# EAGLE design backplane (EAGLE 8.0.0)
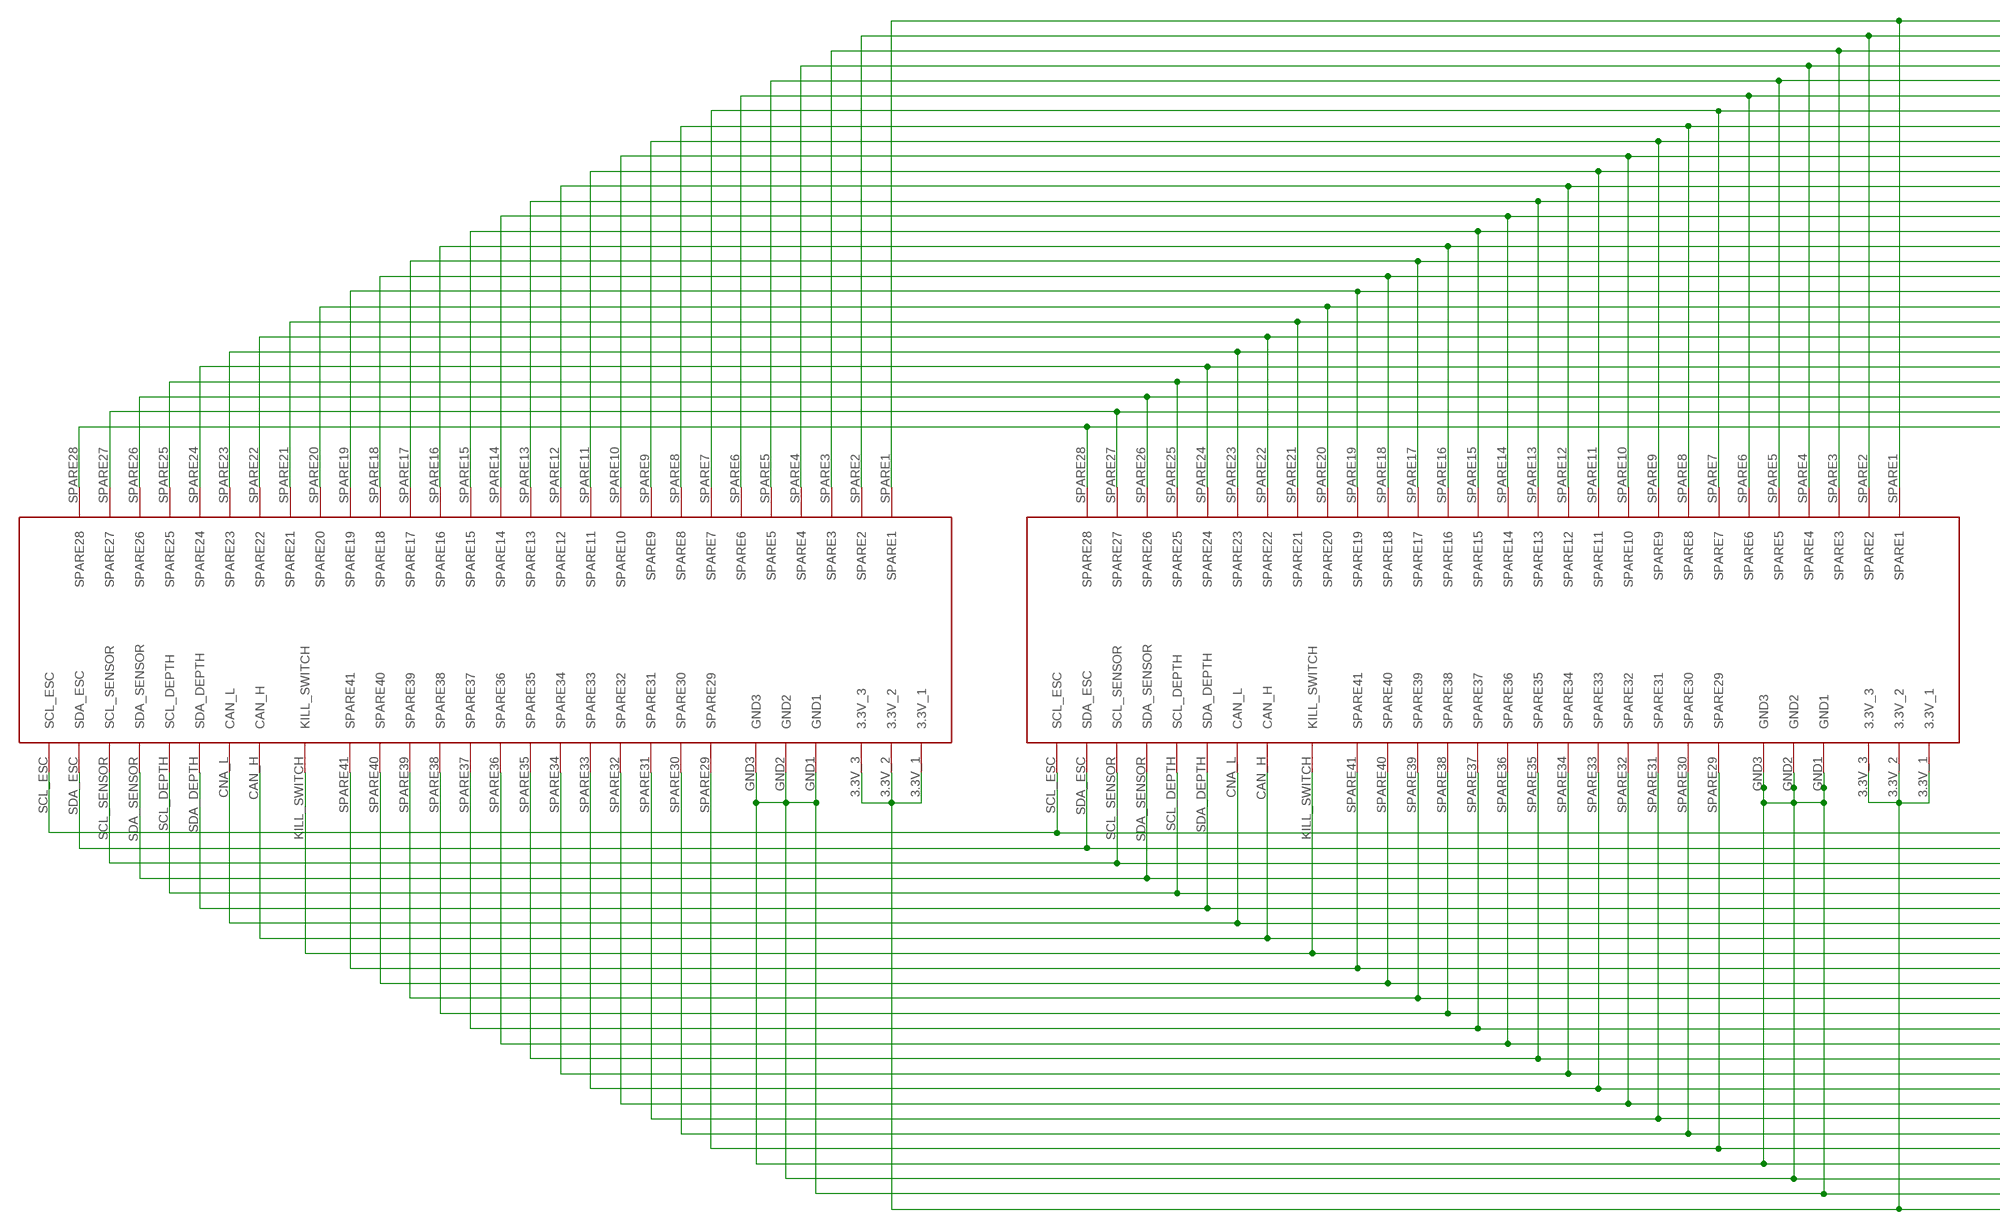
[diagram p0: schematic, sheet 1, part 1 of 2]
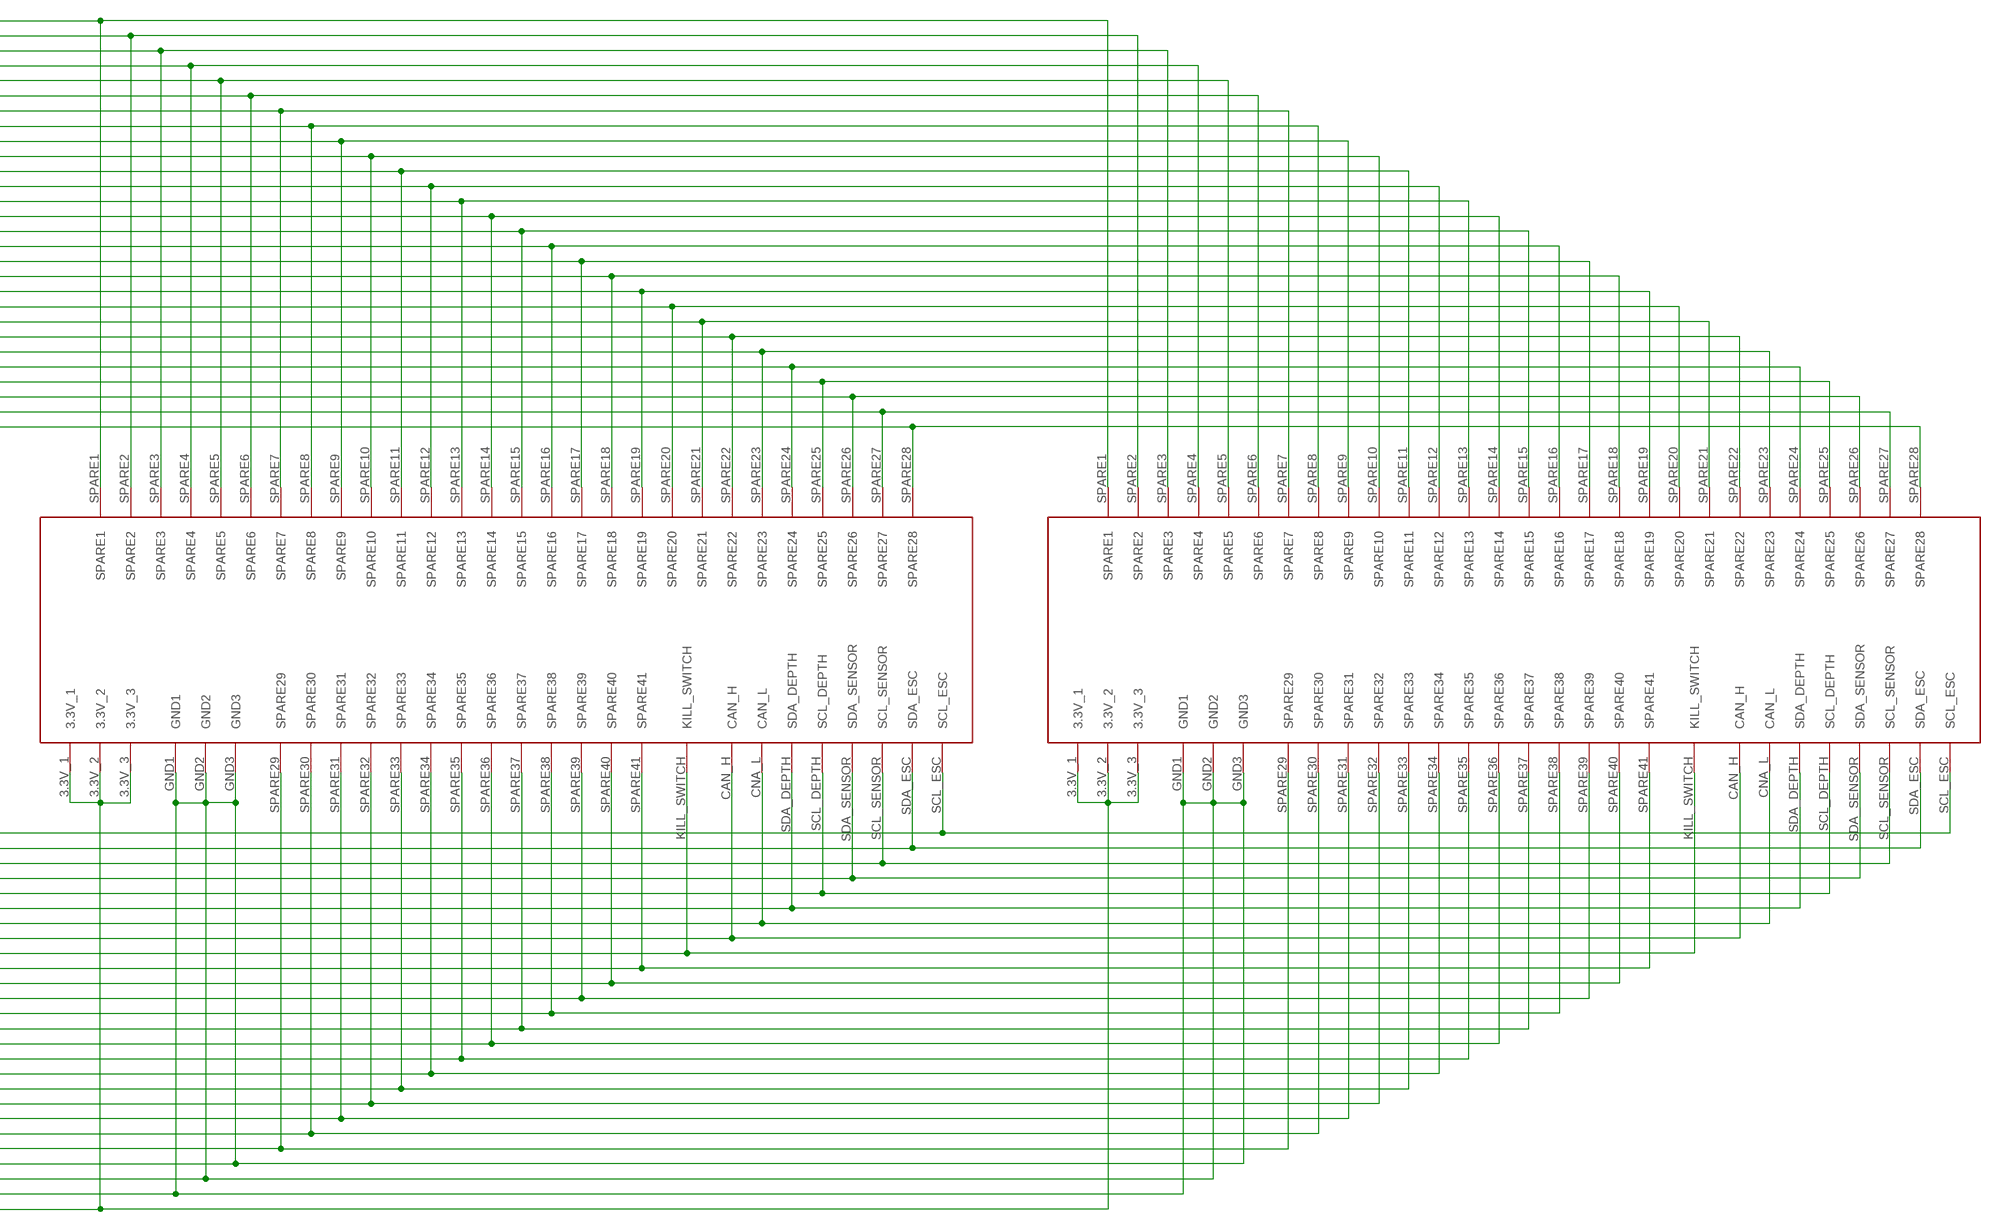
[diagram p1: schematic, sheet 1, part 2 of 2]

## Parts
CO-PROCESSOR  5530843_MATE  [5530843-6-BACKPLANEMATE]
CONVERTER  5530843_MATE  [5530843-6-BACKPLANEMATE]
EXTRA  5530843_MATE  [5530843-6-BACKPLANEMATE]
LOAD_BALANCER  5530843_MATE  [5530843-6-BACKPLANEMATE]

## Nets
3.3: CO-PROCESSOR.3.3V_1 CO-PROCESSOR.3.3V_2 CO-PROCESSOR.3.3V_3 CO-PROCESSOR.SPARE1 CO-PROCESSOR.SPARE2 CO-PROCESSOR.SPARE3 CONVERTER.3.3V_1 CONVERTER.3.3V_2 CONVERTER.3.3V_3 CONVERTER.SPARE1 CONVERTER.SPARE2 CONVERTER.SPARE3 EXTRA.3.3V_1 EXTRA.3.3V_2 EXTRA.3.3V_3 EXTRA.SPARE1 EXTRA.SPARE2 EXTRA.SPARE3 LOAD_BALANCER.3.3V_1 LOAD_BALANCER.3.3V_2 LOAD_BALANCER.3.3V_3 LOAD_BALANCER.SPARE1 LOAD_BALANCER.SPARE2 LOAD_BALANCER.SPARE3
CAN_H: CO-PROCESSOR.CAN_H CONVERTER.CAN_H EXTRA.CAN_H LOAD_BALANCER.CAN_H
CAN_L: CO-PROCESSOR.CNA_L(CAN_L) CONVERTER.CNA_L(CAN_L) EXTRA.CNA_L(CAN_L) LOAD_BALANCER.CNA_L(CAN_L)
GND: CO-PROCESSOR.GND1 CO-PROCESSOR.GND2 CO-PROCESSOR.GND3 CO-PROCESSOR.SPARE4 CO-PROCESSOR.SPARE5 CO-PROCESSOR.SPARE6 CONVERTER.GND1 CONVERTER.GND2 CONVERTER.GND3 CONVERTER.SPARE4 CONVERTER.SPARE5 CONVERTER.SPARE6 EXTRA.GND1 EXTRA.GND2 EXTRA.GND3 EXTRA.SPARE4 EXTRA.SPARE5 EXTRA.SPARE6 LOAD_BALANCER.GND1 LOAD_BALANCER.GND2 LOAD_BALANCER.GND3 LOAD_BALANCER.SPARE4 LOAD_BALANCER.SPARE5 LOAD_BALANCER.SPARE6
KILL_SWITCH: CO-PROCESSOR.KILL_SWITCH CONVERTER.KILL_SWITCH EXTRA.KILL_SWITCH LOAD_BALANCER.KILL_SWITCH
SCL_DEPTH: CO-PROCESSOR.SCL_DEPTH CONVERTER.SCL_DEPTH EXTRA.SCL_DEPTH LOAD_BALANCER.SCL_DEPTH
SCL_ESC: CO-PROCESSOR.SCL_ESC CONVERTER.SCL_ESC EXTRA.SCL_ESC LOAD_BALANCER.SCL_ESC
SCL_SENSOR: CO-PROCESSOR.SCL_SENSOR CONVERTER.SCL_SENSOR EXTRA.SCL_SENSOR LOAD_BALANCER.SCL_SENSOR
SDA_DEPTH: CO-PROCESSOR.SDA_DEPTH CONVERTER.SDA_DEPTH EXTRA.SDA_DEPTH LOAD_BALANCER.SDA_DEPTH
SDA_ESC: CO-PROCESSOR.SDA_ESC CONVERTER.SDA_ESC EXTRA.SDA_ESC LOAD_BALANCER.SDA_ESC
SDA_SENSOR: CO-PROCESSOR.SDA_SENSOR CONVERTER.SDA_SENSOR EXTRA.SDA_SENSOR LOAD_BALANCER.SDA_SENSOR
SPARE7: CO-PROCESSOR.SPARE7 CONVERTER.SPARE7 EXTRA.SPARE7 LOAD_BALANCER.SPARE7
SPARE8: CO-PROCESSOR.SPARE8 CONVERTER.SPARE8 EXTRA.SPARE8 LOAD_BALANCER.SPARE8
SPARE9: CO-PROCESSOR.SPARE9 CONVERTER.SPARE9 EXTRA.SPARE9 LOAD_BALANCER.SPARE9
SPARE10: CO-PROCESSOR.SPARE10 CONVERTER.SPARE10 EXTRA.SPARE10 LOAD_BALANCER.SPARE10
SPARE11: CO-PROCESSOR.SPARE11 CONVERTER.SPARE11 EXTRA.SPARE11 LOAD_BALANCER.SPARE11
SPARE12: CO-PROCESSOR.SPARE12 CONVERTER.SPARE12 EXTRA.SPARE12 LOAD_BALANCER.SPARE12
SPARE13: CO-PROCESSOR.SPARE13 CONVERTER.SPARE13 EXTRA.SPARE13 LOAD_BALANCER.SPARE13
SPARE14: CO-PROCESSOR.SPARE14 CONVERTER.SPARE14 EXTRA.SPARE14 LOAD_BALANCER.SPARE14
SPARE15: CO-PROCESSOR.SPARE15 CONVERTER.SPARE15 EXTRA.SPARE15 LOAD_BALANCER.SPARE15
SPARE16: CO-PROCESSOR.SPARE16 CONVERTER.SPARE16 EXTRA.SPARE16 LOAD_BALANCER.SPARE16
SPARE17: CO-PROCESSOR.SPARE17 CONVERTER.SPARE17 EXTRA.SPARE17 LOAD_BALANCER.SPARE17
SPARE18: CO-PROCESSOR.SPARE18 CONVERTER.SPARE18 EXTRA.SPARE18 LOAD_BALANCER.SPARE18
SPARE19: CO-PROCESSOR.SPARE19 CONVERTER.SPARE19 EXTRA.SPARE19 LOAD_BALANCER.SPARE19
SPARE20: CO-PROCESSOR.SPARE20 CONVERTER.SPARE20 EXTRA.SPARE20 LOAD_BALANCER.SPARE20
SPARE21: CO-PROCESSOR.SPARE21 CONVERTER.SPARE21 EXTRA.SPARE21 LOAD_BALANCER.SPARE21
SPARE22: CO-PROCESSOR.SPARE22 CONVERTER.SPARE22 EXTRA.SPARE22 LOAD_BALANCER.SPARE22
SPARE23: CO-PROCESSOR.SPARE23 CONVERTER.SPARE23 EXTRA.SPARE23 LOAD_BALANCER.SPARE23
SPARE24: CO-PROCESSOR.SPARE24 CONVERTER.SPARE24 EXTRA.SPARE24 LOAD_BALANCER.SPARE24
SPARE25: CO-PROCESSOR.SPARE25 CONVERTER.SPARE25 EXTRA.SPARE25 LOAD_BALANCER.SPARE25
SPARE26: CO-PROCESSOR.SPARE26 CONVERTER.SPARE26 EXTRA.SPARE26 LOAD_BALANCER.SPARE26
SPARE27: CO-PROCESSOR.SPARE27 CONVERTER.SPARE27 EXTRA.SPARE27 LOAD_BALANCER.SPARE27
SPARE28: CO-PROCESSOR.SPARE28 CONVERTER.SPARE28 EXTRA.SPARE28 LOAD_BALANCER.SPARE28
SPARE29: CO-PROCESSOR.SPARE29 CONVERTER.SPARE29 EXTRA.SPARE29 LOAD_BALANCER.SPARE29
SPARE30: CO-PROCESSOR.SPARE30 CONVERTER.SPARE30 EXTRA.SPARE30 LOAD_BALANCER.SPARE30
SPARE31: CO-PROCESSOR.SPARE31 CONVERTER.SPARE31 EXTRA.SPARE31 LOAD_BALANCER.SPARE31
SPARE32: CO-PROCESSOR.SPARE32 CONVERTER.SPARE32 EXTRA.SPARE32 LOAD_BALANCER.SPARE32
SPARE33: CO-PROCESSOR.SPARE33 CONVERTER.SPARE33 EXTRA.SPARE33 LOAD_BALANCER.SPARE33
SPARE34: CO-PROCESSOR.SPARE34 CONVERTER.SPARE34 EXTRA.SPARE34 LOAD_BALANCER.SPARE34
SPARE35: CO-PROCESSOR.SPARE35 CONVERTER.SPARE35 EXTRA.SPARE35 LOAD_BALANCER.SPARE35
SPARE36: CO-PROCESSOR.SPARE36 CONVERTER.SPARE36 EXTRA.SPARE36 LOAD_BALANCER.SPARE36
SPARE37: CO-PROCESSOR.SPARE37 CONVERTER.SPARE37 EXTRA.SPARE37 LOAD_BALANCER.SPARE37
SPARE38: CO-PROCESSOR.SPARE38 CONVERTER.SPARE38 EXTRA.SPARE38 LOAD_BALANCER.SPARE38
SPARE39: CO-PROCESSOR.SPARE39 CONVERTER.SPARE39 EXTRA.SPARE39 LOAD_BALANCER.SPARE39
SPARE40: CO-PROCESSOR.SPARE40 CONVERTER.SPARE40 EXTRA.SPARE40 LOAD_BALANCER.SPARE40
SPARE41: CO-PROCESSOR.SPARE41 CONVERTER.SPARE41 EXTRA.SPARE41 LOAD_BALANCER.SPARE41

## Library data of the parts
CO-PROCESSOR CONVERTER EXTRA LOAD_BALANCER = 5530843-6 - backplane:5530843_MATE

## Board
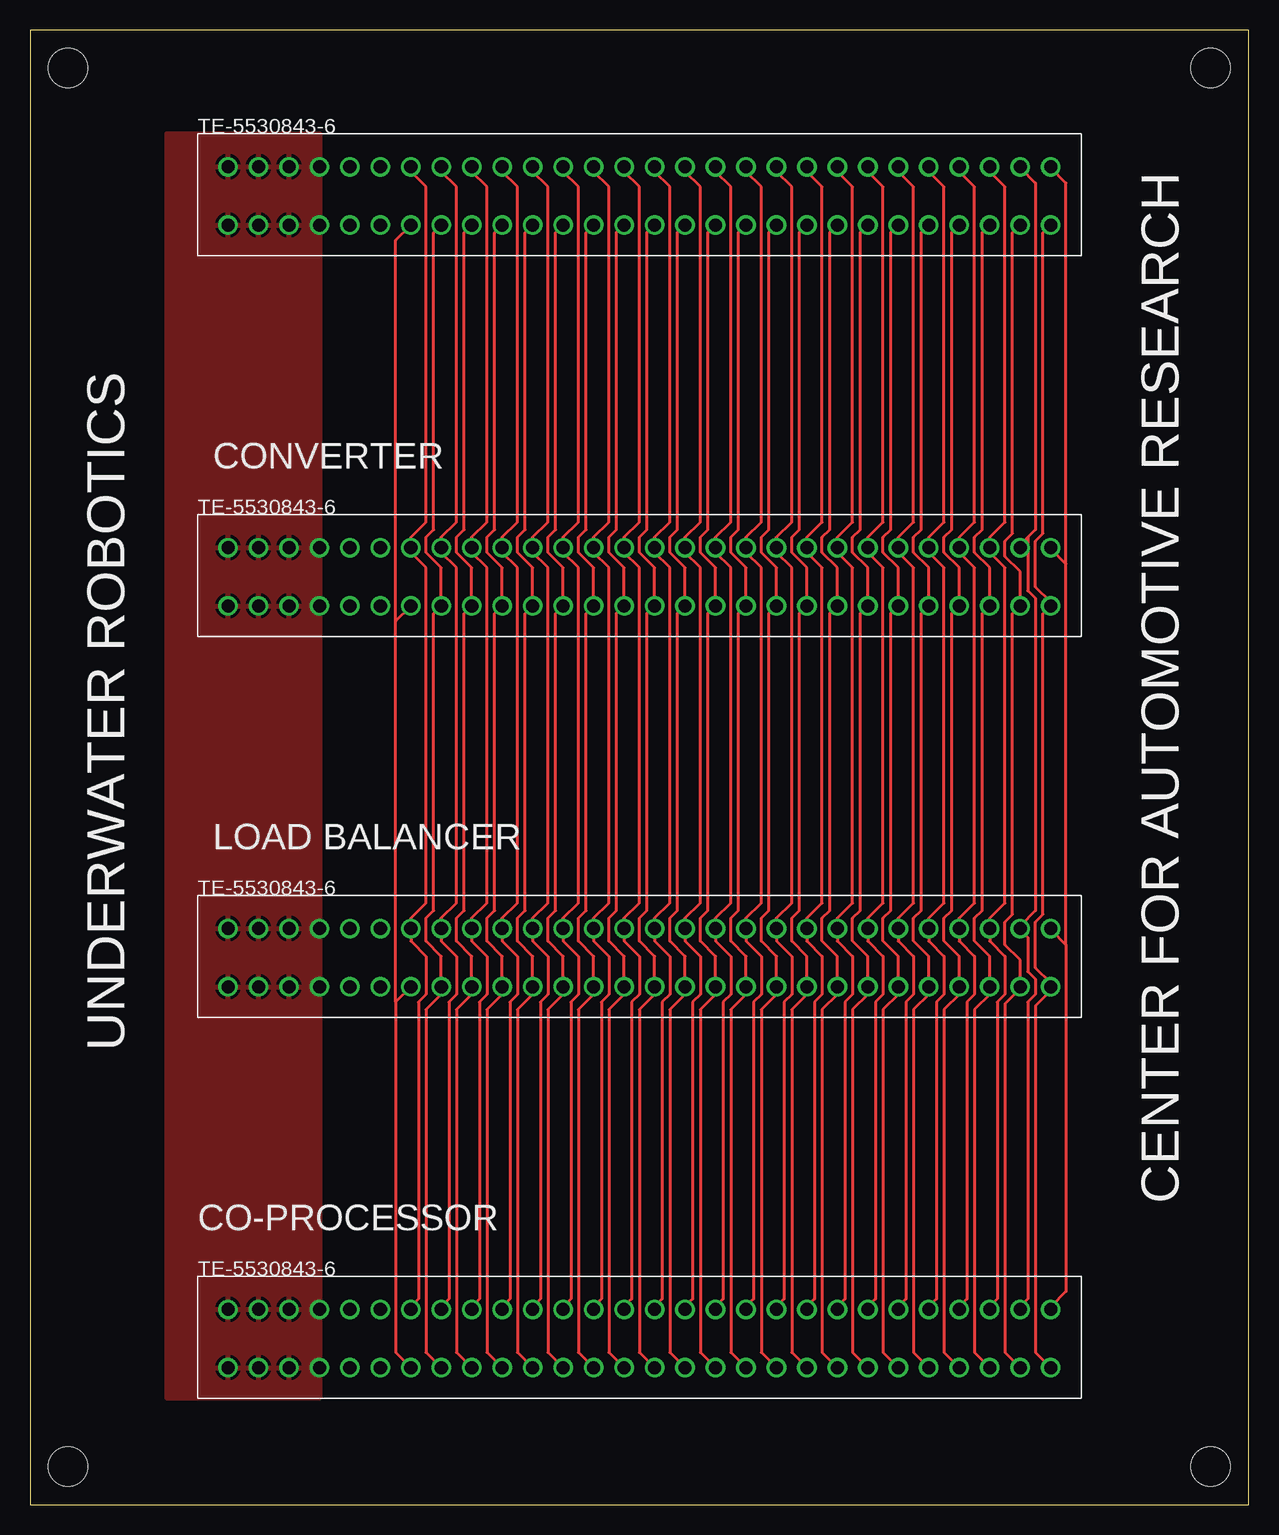
[diagram p2: board, top side]
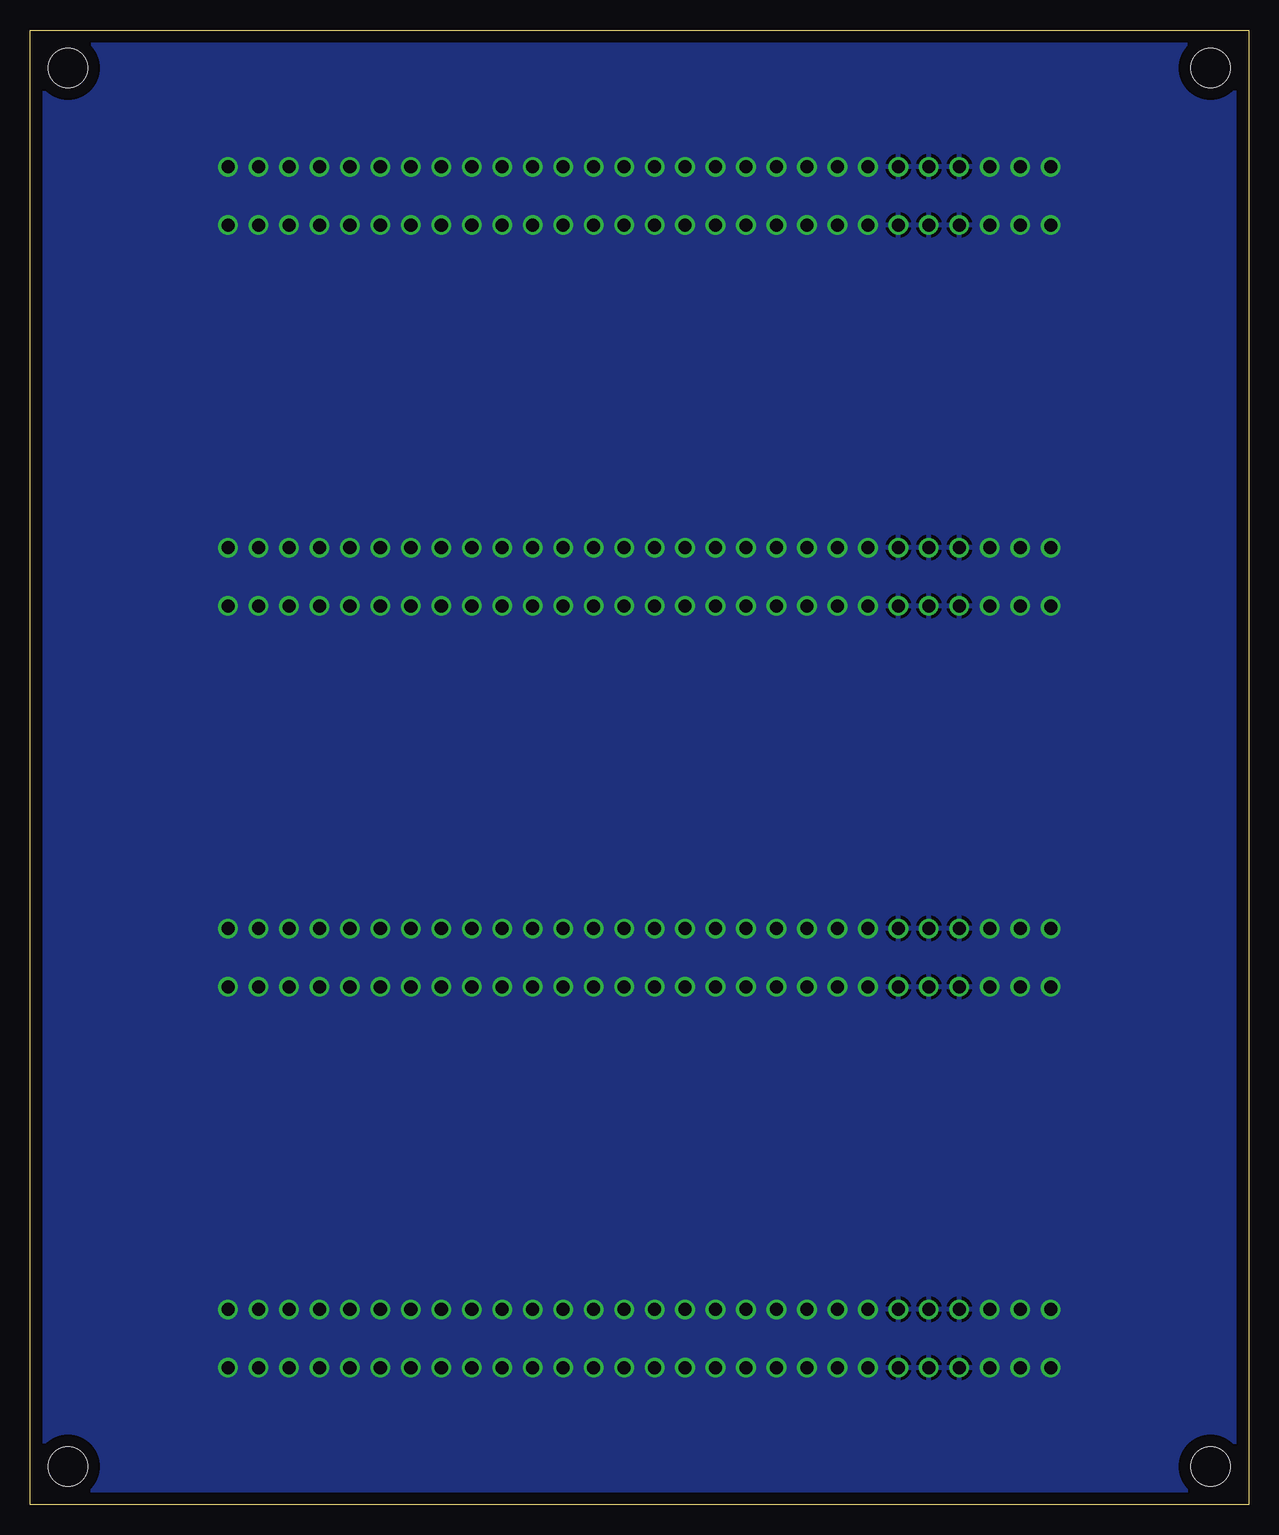
[diagram p3: board, bottom side, seen from below]

Size 101.6 x 122.94 mm. Coordinates in mm from the lower left corner, seen from the top.
Outline: 0,0 101.6,0 101.6,122.94 0,122.94 0,0
Copper layers (1*16): Top 0.035mm / dielectric 1.5mm / Bottom 0.035mm
Design rules "default *": minimum track width 10mil, minimum drill 24mil, track to track 0.000153125mm, track to pad 8mil, pad to pad 8mil, via to via 8mil, smd to smd 8mil, copper to edge 40mil, drill to drill 8mil, minimum pad ring 10mil, minimum via ring 8mil, stop-mask expansion 4mil, vias tented up to drill 0mil, thermal gap 10mil
Holes 3.26 mm at 3.17,3.17 3.17,119.76 98.42,119.76 98.42,3.17

### Footprints (pad centres in the part's own frame; a part is rotated, then mirrored left to right if it is on the bottom)
5530843-6-BACKPLANEMATE = drill 1.092: 3.3V_1 0,0; 3.3V_2 2.54,0; 3.3V_3 5.08,0; CAN_H 50.8,0; CNA_L 53.34,0; GND1 7.62,0; GND2 10.16,0; GND3 12.7,0; KILL_SWITCH 48.26,0; SCL_DEPTH 58.42,0; SCL_ESC 68.58,0; SCL_SENSOR 63.5,0; SDA_DEPTH 55.88,0; SDA_ESC 66.04,0; SDA_SENSOR 60.96,0; SPARE1 0,4.851; SPARE2 2.54,4.851; SPARE3 5.08,4.851; SPARE4 7.62,4.851; SPARE5 10.16,4.851; SPARE6 12.7,4.851; SPARE7 15.24,4.851; SPARE8 17.78,4.851; SPARE9 20.32,4.851; SPARE10 22.86,4.851; SPARE11 25.4,4.851; SPARE12 27.94,4.851; SPARE13 30.48,4.851; SPARE14 33.02,4.851; SPARE15 35.56,4.851; SPARE16 38.1,4.851; SPARE17 40.64,4.851; SPARE18 43.18,4.851; SPARE19 45.72,4.851; SPARE20 48.26,4.851; SPARE21 50.8,4.851; SPARE22 53.34,4.851; SPARE23 55.88,4.851; SPARE24 58.42,4.851; SPARE25 60.96,4.851; SPARE26 63.5,4.851; SPARE27 66.04,4.851; SPARE28 68.58,4.851; SPARE29 15.24,0; SPARE30 17.78,0; SPARE31 20.32,0; SPARE32 22.86,0; SPARE33 25.4,0; SPARE34 27.94,0; SPARE35 30.48,0; SPARE36 33.02,0; SPARE37 35.56,0; SPARE38 38.1,0; SPARE39 40.64,0; SPARE40 43.18,0; SPARE41 45.72,0

### Placement (x,y rotation side)
CO-PROCESSOR  16.51,11.43 0 top
CONVERTER  16.51,106.68 0 top
EXTRA  16.51,74.93 0 top
LOAD_BALANCER  16.51,43.18 0 top

### Tracks (layer width: path | path; a pad name or v marks a point on that pad's centre or on a via)
3.3
  pour Top: 11.43,114.3 24.13,114.3 24.13,8.89 11.43,8.89
CAN_H
  Top 0.254: CO-PROCESSOR.CAN_H 66.04,12.7 66.04,41.27 67.31,42.55 LOAD_BALANCER.CAN_H 67.31,45.72 66.04,46.99 66.04,48.9 66.67,49.53 66.67,74.3 EXTRA.CAN_H 67.31,78.11 66.04,79.38 66.04,80.64 66.67,81.28 66.67,106.05 CONVERTER.CAN_H
CAN_L
  Top 0.254: CO-PROCESSOR.CNA_L 68.58,12.7 68.58,41.27 69.85,42.55 LOAD_BALANCER.CNA_L 69.85,45.72 68.58,46.99 68.58,48.9 69.22,49.53 69.22,74.3 EXTRA.CNA_L 69.85,78.11 68.58,79.38 68.58,80.64 69.22,81.28 69.22,106.05 CONVERTER.CNA_L
GND
  pour Bottom: 0,122.94 101.6,122.94 101.6,0 0,0
KILL_SWITCH
  Top 0.254: CO-PROCESSOR.KILL_SWITCH 63.5,12.7 63.5,41.27 64.77,42.55 LOAD_BALANCER.KILL_SWITCH 64.77,45.72 63.5,46.99 63.5,48.9 64.14,49.53 64.14,74.3 EXTRA.KILL_SWITCH 64.77,78.11 63.5,79.38 63.5,80.64 64.14,81.28 64.14,106.05 CONVERTER.KILL_SWITCH
SCL_DEPTH
  Top 0.254: CO-PROCESSOR.SCL_DEPTH 73.66,12.7 73.66,41.27 74.93,42.55 LOAD_BALANCER.SCL_DEPTH 74.93,45.72 73.66,46.99 73.66,48.9 74.3,49.53 74.3,74.3 EXTRA.SCL_DEPTH 74.93,78.11 73.66,79.38 73.66,80.64 74.3,81.28 74.3,106.05 CONVERTER.SCL_DEPTH
SCL_ESC
  Top 0.254: CO-PROCESSOR.SCL_ESC 83.82,12.7 83.82,41.59 85.09,42.86 LOAD_BALANCER.SCL_ESC 85.09,43.5 83.82,44.77 83.82,48.58 84.45,49.21 84.45,74.3 EXTRA.SCL_ESC 85.09,75.25 83.82,76.52 83.82,80.33 84.45,80.96 84.45,106.05 CONVERTER.SCL_ESC
SCL_SENSOR
  Top 0.254: CO-PROCESSOR.SCL_SENSOR 78.74,12.7 78.74,41.27 80.01,42.55 LOAD_BALANCER.SCL_SENSOR 80.01,45.72 78.74,46.99 78.74,48.9 79.38,49.53 79.38,74.3 EXTRA.SCL_SENSOR 80.01,78.11 78.74,79.38 78.74,80.64 79.38,81.28 79.38,106.05 CONVERTER.SCL_SENSOR
SDA_DEPTH
  Top 0.254: CO-PROCESSOR.SDA_DEPTH 71.12,12.7 71.12,41.27 72.39,42.55 LOAD_BALANCER.SDA_DEPTH 72.39,45.72 71.12,46.99 71.12,48.9 71.75,49.53 71.75,74.3 EXTRA.SDA_DEPTH 72.39,78.11 71.12,79.38 71.12,80.64 71.75,81.28 71.75,106.05 CONVERTER.SDA_DEPTH
SDA_ESC
  Top 0.254: CO-PROCESSOR.SDA_ESC 81.28,12.7 81.28,41.75 82.55,43.02 LOAD_BALANCER.SDA_ESC 82.55,45.4 81.28,46.67 81.28,48.58 81.92,49.21 81.92,74.3 EXTRA.SDA_ESC 82.55,77.79 81.28,79.06 81.28,80.33 81.92,80.96 81.92,106.05 CONVERTER.SDA_ESC
SDA_SENSOR
  Top 0.254: CO-PROCESSOR.SDA_SENSOR 76.2,12.7 76.2,41.27 77.47,42.55 LOAD_BALANCER.SDA_SENSOR 77.47,45.72 76.2,46.99 76.2,48.9 76.83,49.53 76.83,74.3 EXTRA.SDA_SENSOR 77.47,78.11 76.2,79.38 76.2,80.64 76.83,81.28 76.83,106.05 CONVERTER.SDA_SENSOR
SPARE7
  Top 0.254: CO-PROCESSOR.SPARE7 31.75,16.51 32.38,17.14 32.38,41.91 33.02,42.55 33.02,45.72 31.75,46.99 LOAD_BALANCER.SPARE7 31.75,48.9 33.02,50.16 33.02,78.11 31.75,79.38 EXTRA.SPARE7 31.75,80.64 33.02,81.92 33.02,109.86 31.75,111.12 CONVERTER.SPARE7
SPARE8
  Top 0.254: CO-PROCESSOR.SPARE8 34.29,16.51 34.92,17.14 34.92,41.91 35.56,42.55 35.56,45.72 34.29,46.99 LOAD_BALANCER.SPARE8 34.29,48.9 35.56,50.16 35.56,78.11 34.29,79.38 EXTRA.SPARE8 34.29,80.64 35.56,81.92 35.56,109.86 34.29,111.12 CONVERTER.SPARE8
SPARE9
  Top 0.254: CO-PROCESSOR.SPARE9 36.83,16.51 37.47,17.14 37.47,41.91 38.1,42.55 38.1,45.72 36.83,46.99 LOAD_BALANCER.SPARE9 36.83,48.9 38.1,50.16 38.1,78.11 36.83,79.38 EXTRA.SPARE9 36.83,80.64 38.1,81.92 38.1,109.86 36.83,111.12 CONVERTER.SPARE9
SPARE10
  Top 0.254: CO-PROCESSOR.SPARE10 39.37,16.51 40.01,17.14 40.01,41.91 40.64,42.55 40.64,45.72 39.37,46.99 LOAD_BALANCER.SPARE10 39.37,48.9 40.64,50.16 40.64,78.11 39.37,79.38 EXTRA.SPARE10 39.37,80.64 40.64,81.92 40.64,109.86 39.37,111.12 CONVERTER.SPARE10
SPARE11
  Top 0.254: CO-PROCESSOR.SPARE11 41.91,16.51 42.55,17.14 42.55,41.91 43.18,42.55 43.18,45.72 41.91,46.99 LOAD_BALANCER.SPARE11 41.91,48.9 43.18,50.16 43.18,78.11 41.91,79.38 EXTRA.SPARE11 41.91,80.64 43.18,81.92 43.18,109.86 41.91,111.12 CONVERTER.SPARE11
SPARE12
  Top 0.254: CO-PROCESSOR.SPARE12 44.45,16.51 45.09,17.14 45.09,41.91 45.72,42.55 45.72,45.72 44.45,46.99 LOAD_BALANCER.SPARE12 44.45,48.9 45.72,50.16 45.72,78.11 44.45,79.38 EXTRA.SPARE12 44.45,80.64 45.72,81.92 45.72,109.86 44.45,111.12 CONVERTER.SPARE12
SPARE13
  Top 0.254: CO-PROCESSOR.SPARE13 46.99,16.51 47.62,17.14 47.62,41.91 48.26,42.55 48.26,45.72 46.99,46.99 LOAD_BALANCER.SPARE13 46.99,48.9 48.26,50.16 48.26,78.11 46.99,79.38 EXTRA.SPARE13 46.99,80.64 48.26,81.92 48.26,109.86 46.99,111.12 CONVERTER.SPARE13
SPARE14
  Top 0.254: CO-PROCESSOR.SPARE14 49.53,16.51 50.16,17.14 50.16,41.91 50.8,42.55 50.8,45.72 49.53,46.99 LOAD_BALANCER.SPARE14 49.53,48.9 50.8,50.16 50.8,78.11 49.53,79.38 EXTRA.SPARE14 49.53,80.64 50.8,81.92 50.8,109.86 49.53,111.12 CONVERTER.SPARE14
SPARE15
  Top 0.254: CO-PROCESSOR.SPARE15 52.07,16.51 52.7,17.14 52.7,41.91 53.34,42.55 53.34,45.72 52.07,46.99 LOAD_BALANCER.SPARE15 52.07,48.9 53.34,50.16 53.34,78.11 52.07,79.38 EXTRA.SPARE15 52.07,80.64 53.34,81.92 53.34,109.86 52.07,111.12 CONVERTER.SPARE15
SPARE16
  Top 0.254: CO-PROCESSOR.SPARE16 54.61,16.51 55.24,17.14 55.24,41.91 55.88,42.55 55.88,45.72 54.61,46.99 LOAD_BALANCER.SPARE16 54.61,48.9 55.88,50.16 55.88,78.11 54.61,79.38 EXTRA.SPARE16 54.61,80.64 55.88,81.92 55.88,109.86 54.61,111.12 CONVERTER.SPARE16
SPARE17
  Top 0.254: CO-PROCESSOR.SPARE17 57.15,16.51 57.78,17.14 57.78,41.91 58.42,42.55 58.42,45.72 57.15,46.99 LOAD_BALANCER.SPARE17 57.15,48.9 58.42,50.16 58.42,78.11 57.15,79.38 EXTRA.SPARE17 57.15,80.64 58.42,81.92 58.42,109.86 57.15,111.12 CONVERTER.SPARE17
SPARE18
  Top 0.254: CO-PROCESSOR.SPARE18 59.69,16.51 60.33,17.14 60.33,41.91 60.96,42.55 60.96,45.72 59.69,46.99 LOAD_BALANCER.SPARE18 59.69,48.9 60.96,50.16 60.96,78.11 59.69,79.38 EXTRA.SPARE18 59.69,80.64 60.96,81.92 60.96,109.86 59.69,111.12 CONVERTER.SPARE18
SPARE19
  Top 0.254: CO-PROCESSOR.SPARE19 62.23,16.51 62.87,17.14 62.87,41.91 63.5,42.55 63.5,45.72 62.23,46.99 LOAD_BALANCER.SPARE19 62.23,48.9 63.5,50.16 63.5,78.11 62.23,79.38 EXTRA.SPARE19 62.23,80.64 63.5,81.92 63.5,109.86 62.23,111.12 CONVERTER.SPARE19
SPARE20
  Top 0.254: CO-PROCESSOR.SPARE20 64.77,16.51 65.41,17.14 65.41,41.91 66.04,42.55 66.04,45.72 64.77,46.99 LOAD_BALANCER.SPARE20 64.77,48.9 66.04,50.16 66.04,78.11 64.77,79.38 EXTRA.SPARE20 64.77,80.64 66.04,81.92 66.04,109.86 64.77,111.12 CONVERTER.SPARE20
SPARE21
  Top 0.254: CO-PROCESSOR.SPARE21 67.31,16.51 67.94,17.14 67.94,41.91 68.58,42.55 68.58,45.72 67.31,46.99 LOAD_BALANCER.SPARE21 67.31,48.9 68.58,50.16 68.58,78.11 67.31,79.38 EXTRA.SPARE21 67.31,80.64 68.58,81.92 68.58,109.86 67.31,111.12 CONVERTER.SPARE21
SPARE22
  Top 0.254: CO-PROCESSOR.SPARE22 69.85,16.51 70.48,17.14 70.48,41.91 71.12,42.55 71.12,45.72 69.85,46.99 LOAD_BALANCER.SPARE22 69.85,48.9 71.12,50.16 71.12,78.11 69.85,79.38 EXTRA.SPARE22 69.85,80.64 71.12,81.92 71.12,109.86 69.85,111.12 CONVERTER.SPARE22
SPARE23
  Top 0.254: CO-PROCESSOR.SPARE23 72.39,16.51 73.03,17.14 73.03,41.91 73.66,42.55 73.66,45.72 72.39,46.99 LOAD_BALANCER.SPARE23 72.39,48.9 73.66,50.16 73.66,78.11 72.39,79.38 EXTRA.SPARE23 72.39,80.64 73.66,81.92 73.66,109.86 72.39,111.12 CONVERTER.SPARE23
SPARE24
  Top 0.254: CO-PROCESSOR.SPARE24 74.93,16.51 75.56,17.14 75.56,41.91 76.2,42.55 76.2,45.72 74.93,46.99 LOAD_BALANCER.SPARE24 74.93,48.9 76.2,50.16 76.2,78.11 74.93,79.38 EXTRA.SPARE24 74.93,80.64 76.2,81.92 76.2,109.86 74.93,111.12 CONVERTER.SPARE24
SPARE25
  Top 0.254: CO-PROCESSOR.SPARE25 77.47,16.51 78.11,17.14 78.11,41.91 78.74,42.55 78.74,45.72 77.47,46.99 LOAD_BALANCER.SPARE25 77.47,48.9 78.74,50.16 78.74,78.11 77.47,79.38 EXTRA.SPARE25 77.47,80.64 78.74,81.92 78.74,109.86 77.47,111.12 CONVERTER.SPARE25
SPARE26
  Top 0.254: CO-PROCESSOR.SPARE26 80.01,16.51 80.64,17.14 80.64,41.91 81.28,42.55 81.28,45.72 80.01,46.99 LOAD_BALANCER.SPARE26 80.01,48.9 81.28,50.16 81.28,78.11 80.01,79.38 EXTRA.SPARE26 80.01,80.64 81.28,81.92 81.28,109.86 80.01,111.12 CONVERTER.SPARE26
SPARE27
  Top 0.254: CO-PROCESSOR.SPARE27 82.55,16.51 83.19,17.14 83.19,41.91 83.82,42.55 83.82,43.81 83.19,44.45 83.19,47.31 82.55,47.94 LOAD_BALANCER.SPARE27 82.55,48.26 83.82,49.53 83.82,75.56 83.19,76.2 83.19,80.64 | 83.19,80.64 83.82,81.28 83.82,110.17 82.55,111.44 CONVERTER.SPARE27 | 83.19,80.64 82.55,80.01 EXTRA.SPARE27
SPARE28
  Top 0.254: 86.36,46.67 86.36,17.78 85.09,16.51 CO-PROCESSOR.SPARE28 | 86.36,46.67 85.09,47.94 LOAD_BALANCER.SPARE28 | 86.36,78.42 85.09,79.69 EXTRA.SPARE28 | 86.36,46.67 86.36,78.42 | 86.36,78.42 86.36,110.17 85.09,111.44 CONVERTER.SPARE28
SPARE29
  Top 0.254: CO-PROCESSOR.SPARE29 30.48,12.7 30.48,41.91 | LOAD_BALANCER.SPARE29 30.48,41.91 | 30.48,73.66 EXTRA.SPARE29 | 30.48,41.91 30.48,73.66 | CONVERTER.SPARE29 30.48,105.41 30.48,73.66
SPARE30
  Top 0.254: CO-PROCESSOR.SPARE30 33.02,12.7 33.02,41.27 34.29,42.55 LOAD_BALANCER.SPARE30 34.29,45.72 33.02,46.99 33.02,48.9 33.66,49.53 33.66,74.3 EXTRA.SPARE30 34.29,78.11 33.02,79.38 33.02,80.64 33.66,81.28 33.66,106.05 CONVERTER.SPARE30
SPARE31
  Top 0.254: CO-PROCESSOR.SPARE31 35.56,12.7 35.56,41.27 36.83,42.55 LOAD_BALANCER.SPARE31 36.83,45.72 35.56,46.99 35.56,48.9 36.2,49.53 36.2,74.3 EXTRA.SPARE31 36.83,78.11 35.56,79.38 35.56,80.64 36.2,81.28 36.2,106.05 CONVERTER.SPARE31
SPARE32
  Top 0.254: CO-PROCESSOR.SPARE32 38.1,12.7 38.1,41.27 39.37,42.55 LOAD_BALANCER.SPARE32 39.37,45.72 38.1,46.99 38.1,48.9 38.73,49.53 38.73,74.3 EXTRA.SPARE32 39.37,78.11 38.1,79.38 38.1,80.64 38.73,81.28 38.73,106.05 CONVERTER.SPARE32
SPARE33
  Top 0.254: CO-PROCESSOR.SPARE33 40.64,12.7 40.64,41.27 41.91,42.55 LOAD_BALANCER.SPARE33 41.91,45.72 40.64,46.99 40.64,48.9 41.27,49.53 41.27,74.3 EXTRA.SPARE33 41.91,78.11 40.64,79.38 40.64,80.64 41.27,81.28 41.27,106.05 CONVERTER.SPARE33
SPARE34
  Top 0.254: CO-PROCESSOR.SPARE34 43.18,12.7 43.18,41.27 44.45,42.55 LOAD_BALANCER.SPARE34 44.45,45.72 43.18,46.99 43.18,48.9 43.81,49.53 43.81,74.3 EXTRA.SPARE34 44.45,78.11 43.18,79.38 43.18,80.64 43.81,81.28 43.81,106.05 CONVERTER.SPARE34
SPARE35
  Top 0.254: CO-PROCESSOR.SPARE35 45.72,12.7 45.72,41.27 46.99,42.55 LOAD_BALANCER.SPARE35 46.99,45.72 45.72,46.99 45.72,48.9 46.35,49.53 46.35,74.3 EXTRA.SPARE35 46.99,78.11 45.72,79.38 45.72,80.64 46.35,81.28 46.35,106.05 CONVERTER.SPARE35
SPARE36
  Top 0.254: CO-PROCESSOR.SPARE36 48.26,12.7 48.26,41.27 49.53,42.55 LOAD_BALANCER.SPARE36 49.53,45.72 48.26,46.99 48.26,48.9 48.9,49.53 48.9,74.3 EXTRA.SPARE36 49.53,78.11 48.26,79.38 48.26,80.64 48.9,81.28 48.9,106.05 CONVERTER.SPARE36
SPARE37
  Top 0.254: CO-PROCESSOR.SPARE37 50.8,12.7 50.8,41.27 52.07,42.55 LOAD_BALANCER.SPARE37 52.07,45.72 50.8,46.99 50.8,48.9 51.44,49.53 51.44,74.3 EXTRA.SPARE37 52.07,78.11 50.8,79.38 50.8,80.64 51.44,81.28 51.44,106.05 CONVERTER.SPARE37
SPARE38
  Top 0.254: CO-PROCESSOR.SPARE38 53.34,12.7 53.34,41.27 54.61,42.55 LOAD_BALANCER.SPARE38 54.61,45.72 53.34,46.99 53.34,48.9 53.98,49.53 53.98,74.3 EXTRA.SPARE38 54.61,78.11 53.34,79.38 53.34,80.64 53.98,81.28 53.98,106.05 CONVERTER.SPARE38
SPARE39
  Top 0.254: CO-PROCESSOR.SPARE39 55.88,12.7 55.88,41.27 57.15,42.55 LOAD_BALANCER.SPARE39 57.15,45.72 55.88,46.99 55.88,48.9 56.52,49.53 56.52,74.3 EXTRA.SPARE39 57.15,78.11 55.88,79.38 55.88,80.64 56.52,81.28 56.52,106.05 CONVERTER.SPARE39
SPARE40
  Top 0.254: CO-PROCESSOR.SPARE40 58.42,12.7 58.42,41.27 59.69,42.55 LOAD_BALANCER.SPARE40 59.69,45.72 58.42,46.99 58.42,48.9 59.05,49.53 59.05,74.3 EXTRA.SPARE40 59.69,78.11 58.42,79.38 58.42,80.64 59.05,81.28 59.05,106.05 CONVERTER.SPARE40
SPARE41
  Top 0.254: CO-PROCESSOR.SPARE41 60.96,12.7 60.96,41.27 62.23,42.55 LOAD_BALANCER.SPARE41 62.23,45.72 60.96,46.99 60.96,48.9 61.59,49.53 61.59,74.3 EXTRA.SPARE41 62.23,78.11 60.96,79.38 60.96,80.64 61.59,81.28 61.59,106.05 CONVERTER.SPARE41

### Text on the board
tPlace: CONVERTER | LOAD BALANCER | UNDERWATER ROBOTICS | CENTER FOR AUTOMOTIVE RESEARCH | CO-PROCESSOR